# Altium schematic sheet WIFIBT_AP6256.SchDoc
size A3
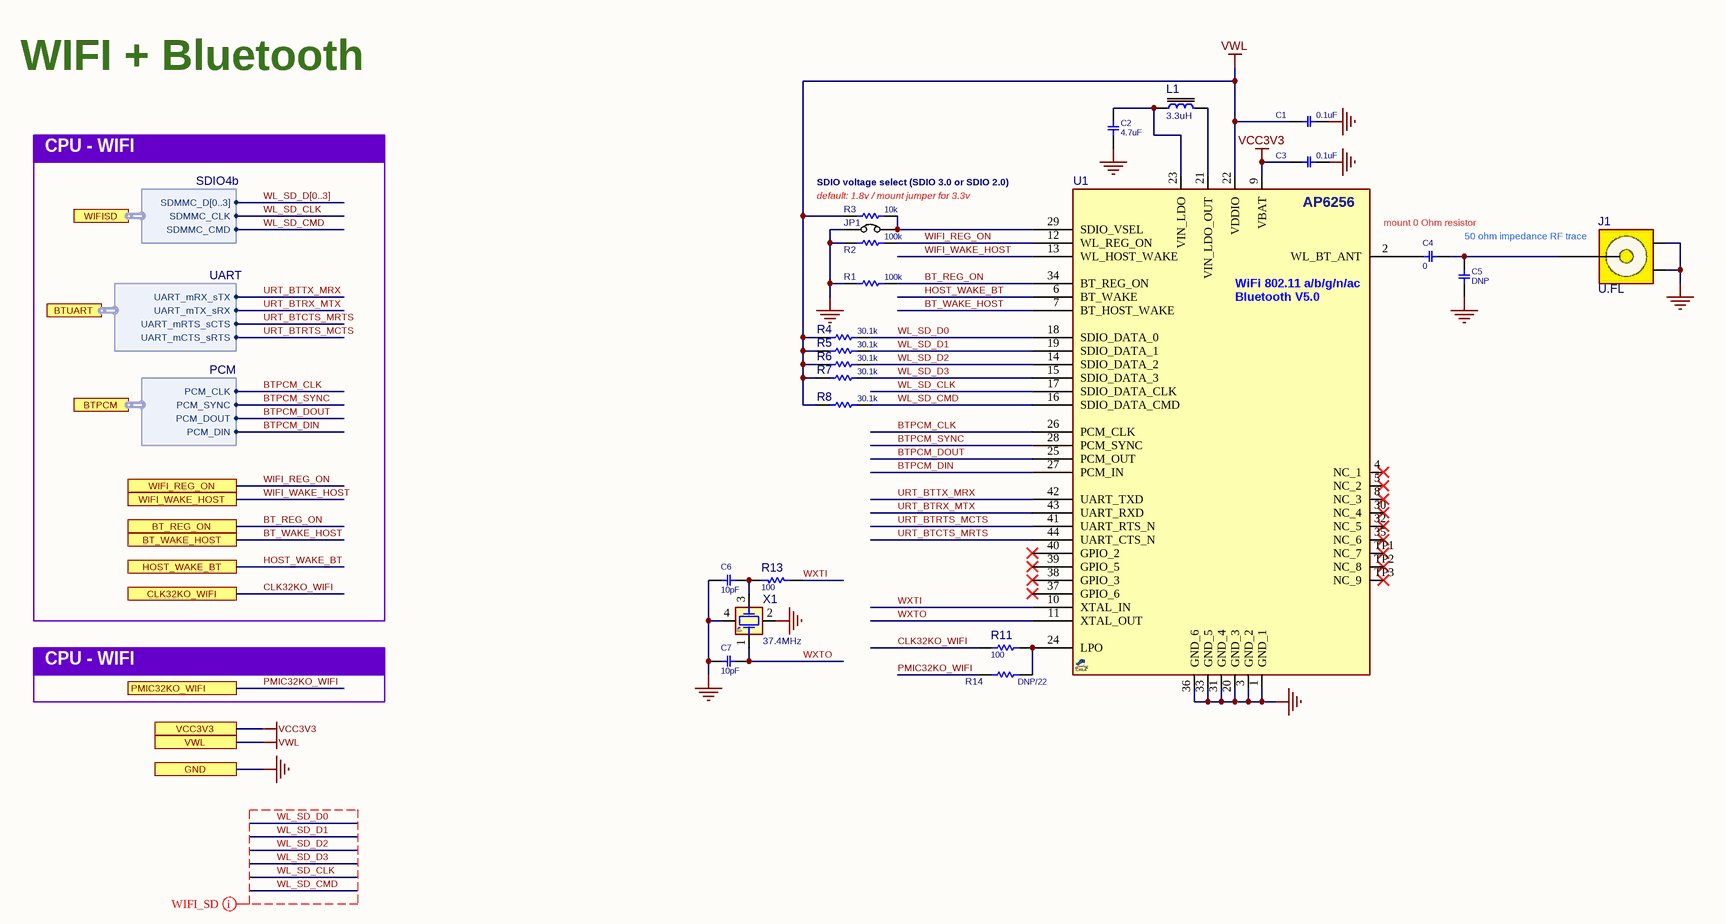
[diagram p0: WIFIBT_AP6256.SchDoc]

## Parts
C1  0.1uF  [C0402]
C2  4.7uF  [C0402]
C3  0.1uF  [C0402]
C4  0  [C0402]
C5  DNP  [C0402]
C6  10pF  [C0402]
C7  10pF  [C0402]
J1  U.FL  [UFL]
JP1  JMPSOLDER  [JP_60X100]  (value not drawn)
L1  3.3uH  [L_3]
R1  100k  [R0402]
R2  100k  [R0402]
R3  10k  [R0402]
R4  30.1k  [R0402]
R5  30.1k  [R0402]
R6  30.1k  [R0402]
R7  30.1k  [R0402]
R8  30.1k  [R0402]
R11  100  [R0402]
R13  100  [R0402]
R14  DNP/22  [R0402]
U1  AP6256  [AP625X_44_12X12]  (value not drawn)
X1  37.4MHz  [XTL_4_2016]

## Ports
BT_REG_ON, BT_WAKE_HOST, BTPCM (harness PCM), BTUART (harness UART), CLK32KO_WIFI, GND, HOST_WAKE_BT, PMIC32KO_WIFI, VCC3V3, VWL, WIFI_REG_ON, WIFI_WAKE_HOST, WIFISD (harness SDIO4b)

## Harnesses
SDIO4b: SDMMC_CMD, SDMMC_D[0..3], SDMMC_CLK
UART: UART_mRX_sTX, UART_mTX_sRX, UART_mRTS_sCTS, UART_mCTS_sRTS
PCM: PCM_CLK, PCM_SYNC, PCM_DOUT, PCM_DIN

## Nets
GND: C1.1 C2.2 C3.1 C5.2 C6.2 C7.2 J1.2(G1) J1.3(G2) JP1.1 R1.2 R2.2 U1.1(GND_1) U1.3(GND_2) U1.20(GND_3) U1.31(GND_4) U1.33(GND_5) U1.36(GND_6) X1.2(GND1) X1.4(GND2) ; port GND
VCC3V3: C3.2 U1.9(VBAT) ; port VCC3V3
VWL: C1.2 R3.2 R4.2 R5.2 R6.2 R7.2 R8.2 U1.22(VDDIO) ; port VWL
BT_REG_ON: R1.1 U1.34(BT_REG_ON) ; port BT_REG_ON
BT_WAKE_HOST: U1.7(BT_HOST_WAKE) ; port BT_WAKE_HOST
BTPCM_CLK: U1.26(PCM_CLK) ; port BTPCM.PCM_CLK
BTPCM_DIN: U1.27(PCM_IN) ; port BTPCM.PCM_DIN
BTPCM_DOUT: U1.25(PCM_OUT) ; port BTPCM.PCM_DOUT
BTPCM_SYNC: U1.28(PCM_SYNC) ; port BTPCM.PCM_SYNC
CLK32KO_WIFI: R11.2 ; port CLK32KO_WIFI
HOST_WAKE_BT: U1.6(BT_WAKE) ; port HOST_WAKE_BT
PMIC32KO_WIFI: R14.2 ; port PMIC32KO_WIFI
URT_BTCTS_MRTS: U1.44(UART_CTS_N) ; port BTUART.UART_mRTS_sCTS
URT_BTRTS_MCTS: U1.41(UART_RTS_N) ; port BTUART.UART_mCTS_sRTS
URT_BTRX_MTX: U1.43(UART_RXD) ; port BTUART.UART_mTX_sRX
URT_BTTX_MRX: U1.42(UART_TXD) ; port BTUART.UART_mRX_sTX
WIFI_REG_ON: R2.1 U1.12(WL_REG_ON) ; port WIFI_REG_ON
WIFI_WAKE_HOST: U1.13(WL_HOST_WAKE) ; port WIFI_WAKE_HOST
WL_SD_CLK: U1.17(SDIO_DATA_CLK) ; port WIFISD.SDMMC_CLK
WL_SD_CMD: R8.1 U1.16(SDIO_DATA_CMD) ; port WIFISD.SDMMC_CMD
WL_SD_D0: R4.1 U1.18(SDIO_DATA_0)
WL_SD_D1: R5.1 U1.19(SDIO_DATA_1)
WL_SD_D2: R6.1 U1.14(SDIO_DATA_2)
WL_SD_D3: R7.1 U1.15(SDIO_DATA_3)
WXTI: R13.2 U1.10(XTAL_IN)
WXTO: C7.1 U1.11(XTAL_OUT) X1.1(XA)
NetC2_1: C2.1 L1.1 U1.23(VIN_LDO)
NetC4_1: C4.1 C5.1 J1.1(SIG)
NetC4_2: C4.2 U1.2(WL_BT_ANT)
NetC6_1: C6.1 R13.1 X1.3(XB)
NetJP1_2: JP1.2 R3.1 U1.29(SDIO_VSEL)
NetL1_2: L1.2 U1.21(VIN_LDO_OUT)
NetR11_1: R11.1 R14.1 U1.24(LPO)

Not connected (* = marked no-connect by the designer): U1 4(NC_1)* 5(NC_2)* 8(NC_3)* 30(NC_4)* 32(NC_5)* 35(NC_6)* 37(GPIO_6)* 38(GPIO_3)* 39(GPIO_5)* 40(GPIO_2)* TP1(NC_7)* TP2(NC_8)* TP3(NC_9)*

## Buses and harness runs
bus WL_SD_D[0..3]

## Layout directives
net class WIFI_SD: WL_SD_CLK, WL_SD_CMD, WL_SD_D0, WL_SD_D1, WL_SD_D2, WL_SD_D3

## Notes on the sheet
- WIFI + Bluetooth
- CPU - WIFI
- SDIO voltage select (SDIO 3.0 or SDIO 2.0)
- (near R3) default: 1.8v / mount jumper for 3.3v
- (near U1) mount 0 Ohm resistor
- (near J1) 50 ohm impedance RF trace
- (in symbol AP6256) WiFi 802.11 a/b/g/n/ac; Bluetooth V5.0

## Library data of the parts
C1 C3 = CAP_SMD_MLCC: CAP, MLCC; PARAM: X7R, 10%, -55~125oC; MANF_P#: GRM155R71H104KE14D; MANF: Murata; PARAM2: 50v; PRICE: 100: 0.018$; ASSEMBLY: ASSEMBLY; VALUE: 0.1uF
C2 = CAP_SMD_MLCC: CAP, MLCC; PARAM: X5R, 20%; MANF_P#: LMK105BBJ475MVLF; MANF: Taiyo Yuden; PARAM2: 10v; PRICE: 10,000: $0.034; ASSEMBLY: ASSEMBLY; VALUE: 4.7uF
C4 C5 = CAP_SMD_MLCC: CAP, MLCC, 1nF, 50V, C0G, 10%, 0402; MANF_P#: MANF_PART#; MANF: Murata; PARAM: C0G, 10%; PRICE: 100= 1$; DESC: CAP, MLCC, 1nF, 50V, C0G, 10%, 0402; PARAM2: 50V; ASSEMBLY: ASSEMBLY
  C4: VALUE: 0
  C5: VALUE: DNP
C6 C7 = CAP_SMD_MLCC: CAP, MLCC; PARAM: C0G, 10%; MANF_P#: CC0402JRNPO9BN100; MANF: Yageo; PARAM2: 50V; PRICE: 100: 0.009$; DESC: CAP, MLCC; ASSEMBLY: ASSEMBLY; VALUE: 10pF
J1 = CONN_RF_UFL: CONN, RF, U.FL, STRAIGHT, Ultra Miniature Coaxial; MANF_P#: CONUFL001-SMD, U.FL-R-SMT-1(10), 128-0711-201; MANF: Linx, Hirose, Cinch; PARAM: 50Ohm, 6GHz; DESC: DESCRIPTION; DIST#: DIGIKEY, MOUSER; PARAM2: GOLD; ASSEMBLY: ASSEMBLY; PRICE: 0.9$; VALUE: U.FL
JP1 = JUMPER_SOLDER: JUMPER, HEADER 2PIN; MANF: MANF; MANF_P#: MANF_P#; VALUE: JMPSOLDER
L1 = INDPWR_SMD: INDUCTOR, POWER, SMD; MANF: Bourns; MANF_P#: SRN3010-3R3M; PARAM2: 20%, 150mOhm; PARAM: 1A; VALUE: 3.3uH
R1-R8 R11 R13 R14 = RES_SMD: RESISTOR, SMD; PARAM: 0.063W; DESC: DESCRIPTION; DIST#: MOUSER; PARAM2: 1%; MANF_P#: -; MANF: -; ASSEMBLY: ASSEMBLY; PRICE: 100= 0.3$
  R1 R2: VALUE: 100k
  R3: VALUE: 10k
  R4-R8: VALUE: 30.1k
  R11 R13: VALUE: 100
  R14: VALUE: DNP/22
U1 = AP6256: WiFi with Bluetooth 5.0; MANF: AMPAK; PARAM2: 3.2~3.8V; PARAM: IEEE 802.11 a/b/g/n/ac; MANF_P#: AP6256; VALUE: AP6256
X1 = XTL_4_40MHz_3225F: CRYSTAL; MANF: Murata; PARAM: 10PPM, -30~85oC; PARAM2: 6pF, 60OhmESR; MANF_P#: XRCGB37M400F1S2FR0; ASSEMBLY: ASSEMBLY; PRICE: 0.6$; VALUE: 37.4MHz